# EAGLE design clare-head (EAGLE 9.6.2)
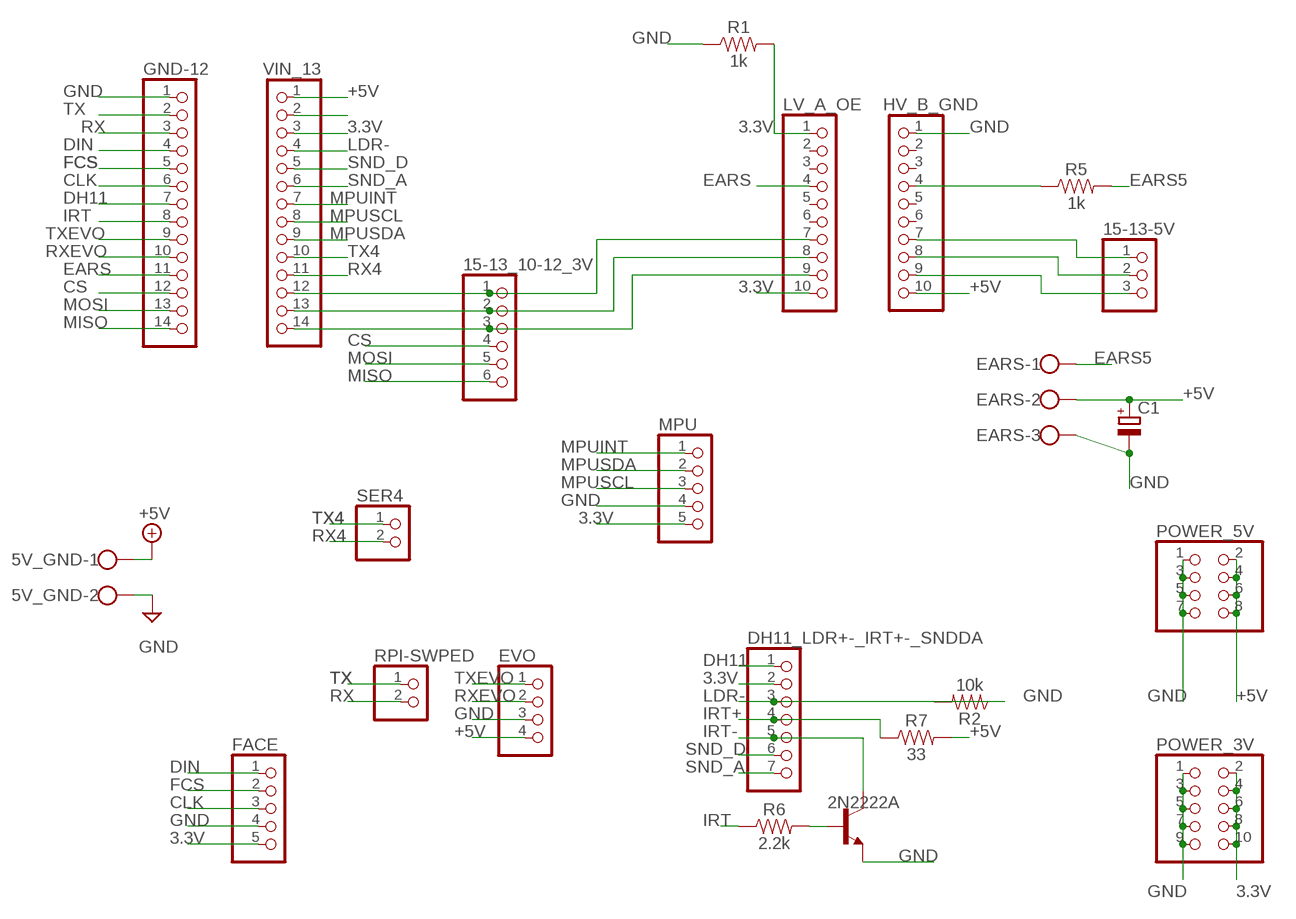
[diagram p0: schematic, sheet 1]

## Parts
2N2222A  2N2222A-NPN-TO18-EBC  [TO18]
5V_GND  W237-102  [W237-102]
15-13-5V  PINHD-1X3  [1X03]
15-13_10-12_3V  PINHD-1X6  [1X06]
C1  CPOL-EUE2,5-6E  [E2,5-6E]
DH11_LDR+-_IRT+-_SNDDA  PINHD-1X7  [1X07]
EARS  W237-103  [W237-103]
EVO  PINHD-1X4  [1X04]
FACE  PINHD-1X5  [1X05]
GND-12  PINHD-1X14  [1X14]
HV_B_GND  PINHD-1X10  [1X10]
LV_A_OE  PINHD-1X10  [1X10]
MPU  PINHD-1X5  [1X05]
POWER_3V  PINHD-2X5  [2X05]
POWER_5V  PINHD-2X4  [2X04]
R1  1k  1KOHM-HORIZ-1/4W-1%  [AXIAL-0.3]
R2  10k  1KOHM-HORIZ-1/4W-1%  [AXIAL-0.3]
R5  1k  1KOHM-HORIZ-1/4W-1%  [AXIAL-0.3]
R6  2.2k  1KOHM-HORIZ-1/4W-1%  [AXIAL-0.3]
R7  33  1KOHM-HORIZ-1/4W-1%  [AXIAL-0.3]
RPI-SWPED  PINHD-1X2  [1X02]
SER4  PINHD-1X2  [1X02]
VIN_13  PINHD-1X14  [1X14]

## Nets
3.3V: DH11_LDR+-_IRT+-_SNDDA.2 FACE.5 LV_A_OE.1 LV_A_OE.10 MPU.5 POWER_3V.2 POWER_3V.4 POWER_3V.6 POWER_3V.8 POWER_3V.10 R1.P$2 VIN_13.3
+5V: 5V_GND.1 C1.+ EARS.2 EVO.4 HV_B_GND.10 POWER_5V.2 POWER_5V.4 POWER_5V.6 POWER_5V.8 R7.P$2 VIN_13.1
CLK: FACE.3 GND-12.6
CS: 15-13_10-12_3V.4 GND-12.12
DH11: DH11_LDR+-_IRT+-_SNDDA.1 GND-12.7
DIN: FACE.1 GND-12.4
EARS: GND-12.11 LV_A_OE.4
EARS5: EARS.1 R5.P$2
FCS: FACE.2 GND-12.5
GND: 2N2222A.1(E) 5V_GND.2 C1.- EARS.3 EVO.3 FACE.4 GND-12.1 HV_B_GND.1 MPU.4 POWER_3V.1 POWER_3V.3 POWER_3V.5 POWER_3V.7 POWER_3V.9 POWER_5V.1 POWER_5V.3 POWER_5V.5 POWER_5V.7 R1.P$1 R2.P$1
IRT: GND-12.8 R6.P$1
IRT+: DH11_LDR+-_IRT+-_SNDDA.4 R7.P$1
IRT-: 2N2222A.3(C) DH11_LDR+-_IRT+-_SNDDA.5
LDR-: DH11_LDR+-_IRT+-_SNDDA.3 R2.P$2 VIN_13.4
MISO: 15-13_10-12_3V.6 GND-12.14
MOSI: 15-13_10-12_3V.5 GND-12.13
MPUINT: MPU.1 VIN_13.7
MPUSCL: MPU.3 VIN_13.8
MPUSDA: MPU.2 VIN_13.9
N$2: VIN_13.2
N$3: 2N2222A.2(B) R6.P$2
N$7: 15-13-5V.1 HV_B_GND.7
N$8: HV_B_GND.4 R5.P$1
N$9: 15-13-5V.2 HV_B_GND.8
N$10: 15-13-5V.3 HV_B_GND.9
N$14: 15-13_10-12_3V.1 LV_A_OE.7 VIN_13.12
N$15: 15-13_10-12_3V.2 LV_A_OE.8 VIN_13.13
N$16: 15-13_10-12_3V.3 LV_A_OE.9 VIN_13.14
RX: GND-12.3 RPI-SWPED.2
RX4: SER4.2 VIN_13.11
RXEVO: EVO.2 GND-12.10
SND_A: DH11_LDR+-_IRT+-_SNDDA.7 VIN_13.6
SND_D: DH11_LDR+-_IRT+-_SNDDA.6 VIN_13.5
TX: GND-12.2 RPI-SWPED.1
TX4: SER4.1 VIN_13.10
TXEVO: EVO.1 GND-12.9
Unconnected: HV_B_GND.2 HV_B_GND.3 HV_B_GND.5 HV_B_GND.6 LV_A_OE.2 LV_A_OE.3 LV_A_OE.5 LV_A_OE.6

## Library data of the parts
2N2222A = transistor:*-NPN-: NPN Transistror BF959 corrected 2008.03.06
5V_GND = con-wago-500:W237-102: WAGO SCREW CLAMP; MPN: 237-102; OC_FARNELL: unknown; OC_NEWARK: 70K9898
15-13-5V = pinhead:PINHD-1X3: PIN HEADER
15-13_10-12_3V = pinhead:PINHD-1X6: PIN HEADER
C1 = rcl:CPOL-EU: POLARIZED CAPACITOR, European symbol; SPICEPREFIX: C
DH11_LDR+-_IRT+-_SNDDA = pinhead:PINHD-1X7: PIN HEADER
EARS = con-wago-500:W237-103: WAGO SCREW CLAMP; MPN: 237-103; OC_FARNELL: unknown; OC_NEWARK: 18M7116
EVO = pinhead:PINHD-1X4: PIN HEADER
FACE MPU = pinhead:PINHD-1X5: PIN HEADER
GND-12 VIN_13 = pinhead:PINHD-1X14: PIN HEADER
HV_B_GND LV_A_OE = pinhead:PINHD-1X10: PIN HEADER
POWER_3V = pinhead:PINHD-2X5: PIN HEADER
POWER_5V = pinhead:PINHD-2X4: PIN HEADER
R1 R5 = SparkFun-Resistors:1KOHM: 1kΩ resistor A resistor is a passive two-terminal electrical component that implements electrical resistance as a circuit element. Resistors act to reduce current flow, and, at the same time, act to lower voltage levels within circuits. - Wikipedia; PROD_ID: RES-12182
R2 R6 R7 = SparkFun-Resistors:1KOHM: 1kΩ resistor A resistor is a passive two-terminal electrical component that implements electrical resistance as a circuit element. Resistors act to reduce current flow, and, at the same time, act to lower voltage levels within circuits. - Wikipedia; PROD_ID: RES-12182; VALUE: 1k
RPI-SWPED SER4 = pinhead:PINHD-1X2: PIN HEADER

## Board
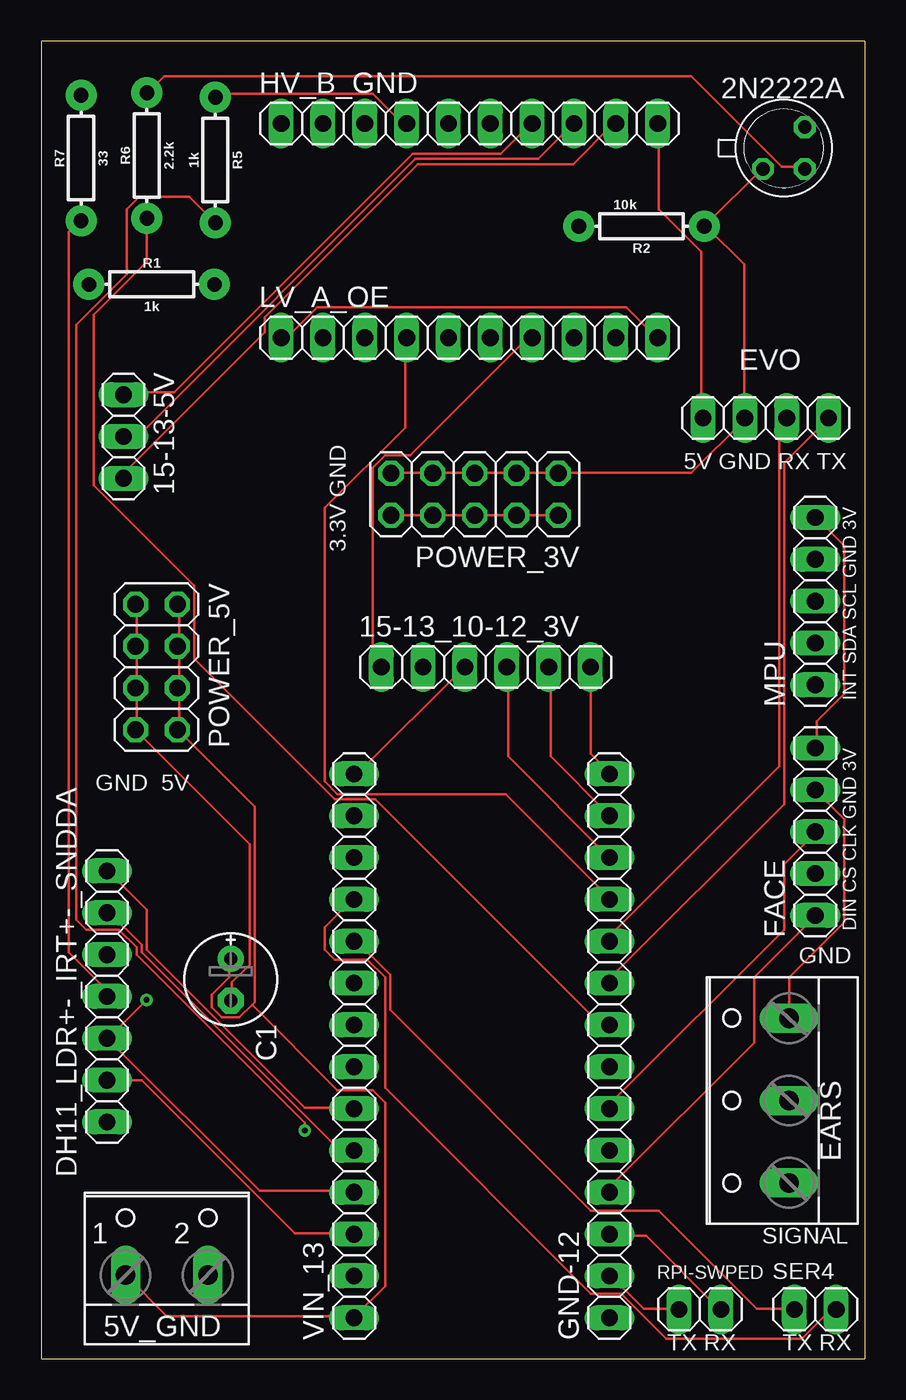
[diagram p1: board, top side]
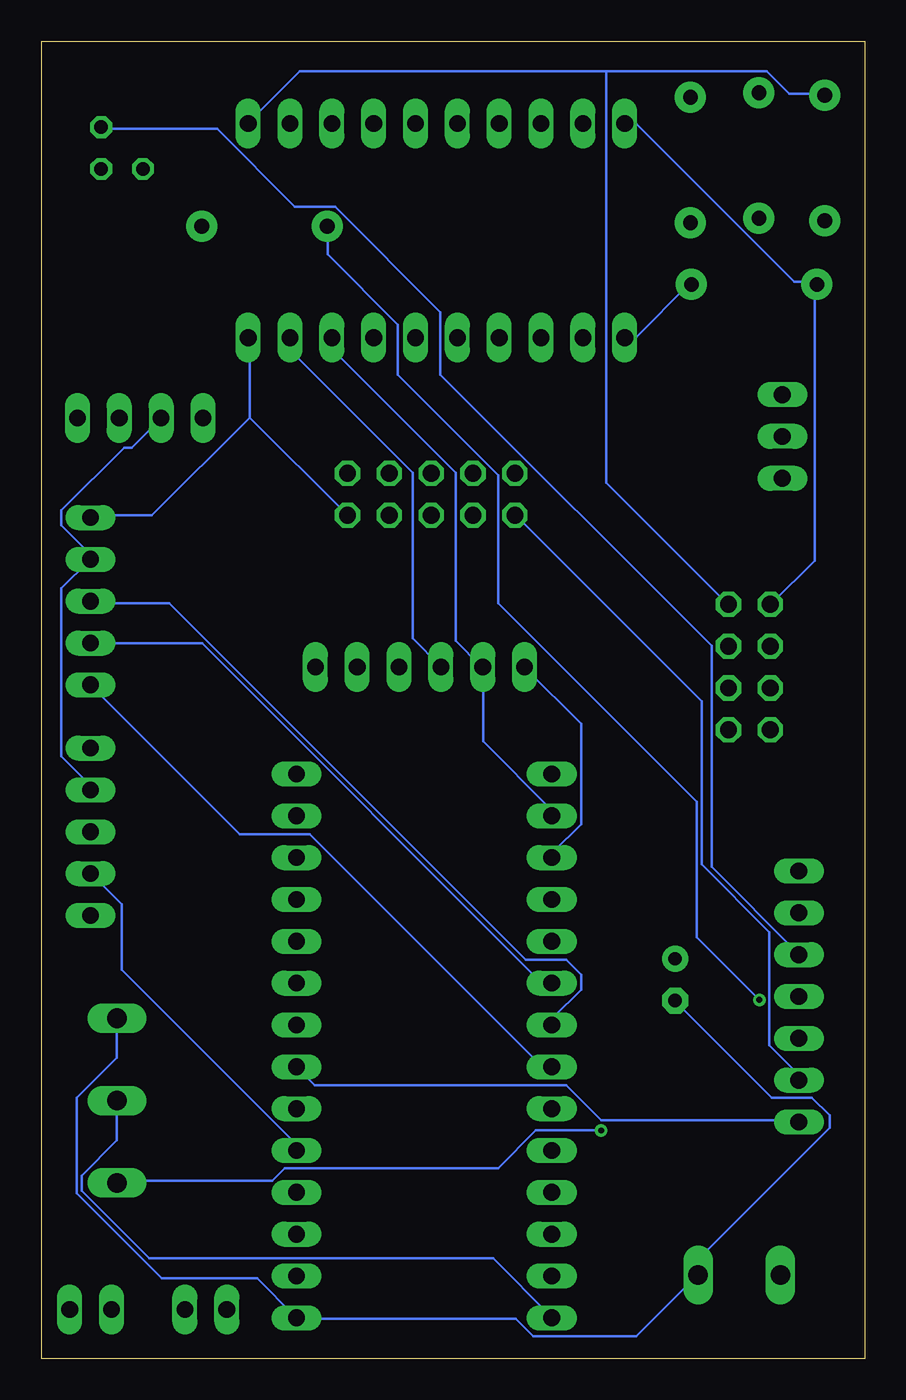
[diagram p2: board, bottom side, seen from below]

Size 50 x 80 mm. Coordinates in mm from the lower left corner, seen from the top.
Outline: 0,0 50,0 50,80 0,80 0,0
Copper layers (1*16): Top 0.035mm / dielectric 1.5mm / Bottom 0.035mm
Design rules "default": minimum track width 6mil, minimum drill 0.35mm, track to track 6mil, track to pad 6mil, pad to pad 6mil, via to via 6mil, smd to smd 6mil, copper to edge 40mil, drill to drill 6mil, minimum pad ring 10mil, minimum via ring 8mil, stop-mask expansion 4mil, vias tented up to drill 0mil, thermal gap 10mil

### Footprints (pad centres in the part's own frame; a part is rotated, then mirrored left to right if it is on the bottom)
TO18 = drill 0.813 octagon: 1 -1.27,-1.27; 2 1.27,-1.27; 3 1.27,1.27
W237-102 = drill 1.194 long: 1 -2.5,-1.27; 2 2.5,-1.27
1X03 = drill 1.016 long: 1 -2.54,0; 2 0,0; 3 2.54,0
1X06 = drill 1.016 long: 1 -6.35,0; 2 -3.81,0; 3 -1.27,0; 4 1.27,0; 5 3.81,0; 6 6.35,0
E2,5-6E = drill 0.813 pad 1.575: + -1.27,0 | drill 0.813 pad 1.575 octagon: - 1.27,0
1X07 = drill 1.016 long: 1 -7.62,0; 2 -5.08,0; 3 -2.54,0; 4 0,0; 5 2.54,0; 6 5.08,0; 7 7.62,0
W237-103 = drill 1.194 long: 1 -5,-1.29; 2 0,-1.29; 3 5,-1.29
1X04 = drill 1.016 long: 1 -3.81,0; 2 -1.27,0; 3 1.27,0; 4 3.81,0
1X05 = drill 1.016 long: 1 -5.08,0; 2 -2.54,0; 3 0,0; 4 2.54,0; 5 5.08,0
1X14 = drill 1.016 long: 1 -16.51,0; 2 -13.97,0; 3 -11.43,0; 4 -8.89,0; 5 -6.35,0; 6 -3.81,0; 7 -1.27,0; 8 1.27,0; 9 3.81,0; 10 6.35,0; 11 8.89,0; 12 11.43,0; 13 13.97,0; 14 16.51,0
1X10 = drill 1.016 long: 1 -11.43,0; 2 -8.89,0; 3 -6.35,0; 4 -3.81,0; 5 -1.27,0; 6 1.27,0; 7 3.81,0; 8 6.35,0; 9 8.89,0; 10 11.43,0
2X05 = drill 1.016 octagon: 1 -5.08,-1.27; 2 -5.08,1.27; 3 -2.54,-1.27; 4 -2.54,1.27; 5 0,-1.27; 6 0,1.27; 7 2.54,-1.27; 8 2.54,1.27; 9 5.08,-1.27; 10 5.08,1.27
2X04 = drill 1.016 octagon: 1 -3.81,-1.27; 2 -3.81,1.27; 3 -1.27,-1.27; 4 -1.27,1.27; 5 1.27,-1.27; 6 1.27,1.27; 7 3.81,-1.27; 8 3.81,1.27
AXIAL-0.3 = drill 0.9 pad 1.88: P$1 -3.81,0; P$2 3.81,0
1X02 = drill 1.016 long: 1 -1.27,0; 2 1.27,0

### Placement (x,y rotation side)
2N2222A  45.09,73.51 0 top
5V_GND  7.62,6.35 0 top
15-13-5V  5,56 270 top
15-13_10-12_3V  27,42 0 top
C1  11.51,23.02 270 top
DH11_LDR+-_IRT+-_SNDDA  4,22 90 top
EARS  44.11,15.68 90 top
EVO  43.99,57.12 180 top
FACE  47,32 90 top
GND-12  34.5,19 90 top
HV_B_GND  26,75 0 top
LV_A_OE  26,62 0 top
MPU  47,46 90 top
POWER_3V  26.32,52.49 180 top
POWER_5V  7,42 270 top
R1  6.71,65.23 0 top
R2  36.45,68.77 180 top
R5  10.58,72.78 270 top
R6  6.42,73.06 90 top
R7  2.42,72.9 90 top
RPI-SWPED  40,3 0 top
SER4  47,3 0 top
VIN_13  19,19 90 top

### Tracks (layer width: path | path; a pad name or v marks a point on that pad's centre or on a via)
3.3V
  Top 0.152: DH11_LDR+-_IRT+-_SNDDA.2 4.12,16.92 6.1,16.92 15.39,7.62 18.9,7.62 VIN_13.3 | FACE.5 47.09,37.19 47.09,38.71 48.77,40.39 48.77,49.38 47.09,51.05 MPU.5 | POWER_3V.10 21.34,51.21 23.77,51.21 POWER_3V.8 23.93,51.21 26.21,51.21 POWER_3V.6 26.36,51.21 28.8,51.21 POWER_3V.4 28.96,51.21 31.39,51.21 POWER_3V.2 | LV_A_OE.1 14.63,62.03 14.94,62.03 16.76,63.86 35.51,63.86 37.34,62.03 LV_A_OE.10
  Bottom 0.152: LV_A_OE.1 14.48,62.03 13.87,62.03 10.67,65.23 R1.P$2 | 37.34,57.15 37.34,61.87 LV_A_OE.10 | 37.34,57.15 31.55,51.36 POWER_3V.2 | 37.34,57.15 43.28,51.21 46.94,51.21 MPU.5 | DH11_LDR+-_IRT+-_SNDDA.2 4.12,17.07 4.12,17.37 5.79,19.05 5.79,25.91 9.91,30.02 9.91,39.93 21.18,51.21 POWER_3V.10
+5V
  Top 0.152: EVO.4 40.08,57.15 40.08,67.21 37.49,69.8 37.49,74.98 HV_B_GND.10 | POWER_5V.2 8.38,45.72 8.38,43.28 POWER_5V.4 8.38,43.13 8.38,40.84 POWER_5V.6 8.38,40.69 8.38,38.25 POWER_5V.8 8.38,38.1 12.95,33.53 12.95,21.64 12.8,21.49 | 12.8,21.49 12.04,20.73 10.97,20.73 10.36,21.34 10.36,22.1 11.43,23.16 11.43,24.23 C1.+ | 5V_GND.1 5.18,5.03 7.62,2.59 18.9,2.59 VIN_13.1 19.05,2.59 20.88,4.42 20.88,15.54 20.12,16.31 17.98,16.31 12.8,21.49
  Bottom 0.152: 15.7,78.18 34.29,78.18 37.34,75.13 HV_B_GND.10 | 15.7,78.18 5.94,78.18 4.57,76.81 2.44,76.81 R7.P$2 | EARS.2 45.41,15.54 45.41,13.26 47.55,11.12 47.55,10.21 43.43,6.1 22.55,6.1 19.05,2.59 VIN_13.1 | 15.7,78.18 15.7,53.19 8.38,45.87 POWER_5V.2
CLK
  Top 0.152: GND-12.6 34.59,15.24 34.59,15.54 45.11,26.06 45.11,30.02 46.94,31.85 FACE.3
CS
  Top 0.152: 15-13_10-12_3V.4 28.35,41.91 28.35,36.58 34.44,30.48 GND-12.12
DH11
  Bottom 0.152: DH11_LDR+-_IRT+-_SNDDA.1 4.12,14.48 16,14.48 18.14,16.61 33.38,16.61 34.44,17.68 GND-12.7
DIN
  Top 0.152: GND-12.4 34.59,10.21 34.59,10.52 43.28,19.2 43.28,23.16 46.94,26.82 FACE.1
EARS
  Top 0.152: LV_A_OE.4 22.1,61.87 22.1,56.54 17.22,51.66 17.22,35.05 17.98,34.29 28.19,34.29 34.44,28.04 GND-12.11
EARS5  (via drill 0.35)
  Top 0.152: v16,13.87 16,14.33 5.79,24.54 5.79,24.99 4.72,26.06 2.74,26.06 2.13,26.67 2.13,62.79 5.18,65.84 5.18,69.8 5.94,70.56 8.99,70.56 10.52,69.04 R5.P$2
  Bottom 0.152: v16,13.87 19.96,13.87 22.25,11.58 35.2,11.58 35.97,10.82 45.26,10.82 EARS.1
FCS
  Bottom 0.152: GND-12.5 34.59,12.8 34.59,13.11 45.11,23.62 45.11,27.58 46.94,29.41 FACE.2
GND
  Top 0.152: EARS.3 45.41,20.73 45.41,23.16 48.77,26.52 48.77,32.77 47.09,34.44 FACE.4 | POWER_3V.9 21.34,53.8 23.77,53.8 POWER_3V.7 23.93,53.8 26.21,53.8 POWER_3V.5 26.36,53.8 28.8,53.8 POWER_3V.3 28.96,53.8 31.39,53.8 POWER_3V.1 31.55,53.8 39.47,53.8 42.67,57 EVO.3 42.67,57.15 42.67,66.45 40.39,68.73 R2.P$1 40.39,68.89 43.74,72.24 2N2222A.1 | POWER_5V.1 5.79,45.72 5.79,43.28 POWER_5V.3 5.79,43.13 5.79,40.84 POWER_5V.5 5.79,40.69 5.79,38.25 POWER_5V.7 5.79,38.1 12.65,31.24 12.65,23.93 11.58,22.86 11.58,21.79 C1.-
  Bottom 0.152: FACE.4 47.09,34.59 47.09,34.9 48.77,36.58 48.77,46.79 47.09,48.46 MPU.4 47.09,48.62 47.09,48.92 48.77,50.6 48.77,51.51 44.96,55.32 44.5,55.32 42.82,57 EVO.3 | HV_B_GND.1 14.48,74.98 13.87,74.98 4.27,65.38 3.05,65.38 R1.P$1 3.05,65.23 3.05,48.46 5.64,45.87 POWER_5V.1 | C1.- 11.43,21.64 5.64,15.85 3.2,15.85 2.13,14.78 2.13,14.02 10.06,6.1 10.06,5.18 5V_GND.2 10.21,5.03 13.87,1.37 20.12,1.37 21.18,2.44 34.44,2.44 GND-12.1 34.59,2.59 36.88,4.88 42.67,4.88 47.85,10.06 47.85,15.85 45.41,18.29 45.41,20.57 EARS.3
IRT
  Top 0.152: GND-12.8 34.44,20.42 33.83,20.42 20.27,33.98 17.83,33.98 9.3,42.52 9.3,46.94 3.2,53.03 3.2,63.4 6.4,66.6 6.4,69.19 R6.P$1
IRT+
  Top 0.152: DH11_LDR+-_IRT+-_SNDDA.4 3.96,22.1 3.96,22.4 1.68,24.69 1.68,68.43 2.29,69.04 R7.P$1
IRT-
  Bottom 0.152: 2N2222A.3 46.33,74.68 39.32,74.68 34.59,69.95 32.16,69.95 25.76,63.55 25.76,59.74 9.3,43.28 9.3,29.87 4.12,24.69 DH11_LDR+-_IRT+-_SNDDA.5
LDR-  (via drill 0.35)
  Top 0.152: VIN_13.4 18.9,10.21 13.26,10.21 4.12,19.36 DH11_LDR+-_IRT+-_SNDDA.3 4.12,19.51 v6.4,21.79
  Bottom 0.152: v6.4,21.79 10.21,25.6 10.21,33.83 22.25,45.87 22.25,53.65 28.35,59.74 28.35,62.79 32.61,67.06 32.61,68.73 R2.P$2
MISO
  Top 0.152: 15-13_10-12_3V.6 33.38,41.91 33.38,36.73 34.44,35.66 GND-12.14
MOSI
  Top 0.152: 15-13_10-12_3V.5 30.94,41.91 30.94,36.58 34.44,33.07 GND-12.13
MPUINT
  Bottom 0.152: VIN_13.7 19.05,17.83 19.66,17.83 33.68,31.85 37.95,31.85 46.94,40.84 MPU.1
MPUSCL
  Bottom 0.152: VIN_13.8 18.9,20.42 18.9,20.73 17.22,22.4 17.22,23.32 18.14,24.23 20.57,24.23 42.22,45.87 46.94,45.87 MPU.3
MPUSDA
  Bottom 0.152: VIN_13.9 19.05,22.86 19.66,22.86 40.23,43.43 46.94,43.43 MPU.2
N$3
  Top 0.152: 2N2222A.2 46.33,72.39 44.96,72.39 39.47,77.88 7.47,77.88 6.55,76.96 R6.P$2
N$7
  Top 0.152: 15-13-5V.1 5.03,58.67 8.08,58.67 22.55,73.15 27.89,73.15 29.72,74.98 HV_B_GND.7
N$8
  Top 0.152: HV_B_GND.4 22.1,75.13 21.79,75.13 20.12,76.81 10.82,76.81 10.67,76.66 R5.P$1
N$9
  Top 0.152: 15-13-5V.2 5.03,56.08 5.94,56.08 22.71,72.85 30.18,72.85 32.31,74.98 HV_B_GND.8
N$10
  Top 0.152: 15-13-5V.3 5.03,53.49 5.03,53.8 13.56,62.33 13.56,63.25 22.86,72.54 32.31,72.54 34.75,74.98 HV_B_GND.9
N$14
  Top 0.152: LV_A_OE.7 29.72,61.87 29.41,61.87 22.4,54.86 20.88,54.86 20.12,54.1 20.12,42.52 20.57,42.06 15-13_10-12_3V.1
  Bottom 0.152: VIN_13.12 18.9,30.48 18.9,30.79 17.22,32.46 17.22,38.56 20.57,41.91 15-13_10-12_3V.1
N$15
  Bottom 0.152: VIN_13.13 19.05,33.07 19.05,33.38 23.16,37.49 23.16,41.91 15-13_10-12_3V.2 23.32,42.06 24.84,43.59 24.84,53.8 32.31,61.27 32.31,61.87 LV_A_OE.8
N$16
  Top 0.152: VIN_13.14 19.05,35.66 19.36,35.66 25.6,41.91 15-13_10-12_3V.3
  Bottom 0.152: LV_A_OE.9 34.75,61.87 34.75,61.11 27.43,53.8 27.43,43.74 25.76,42.06 15-13_10-12_3V.3
RX
  Top 0.152: RPI-SWPED.2 41.15,3.05 36.73,7.47 34.59,7.47 GND-12.3
RX4
  Top 0.152: SER4.2 48.16,2.9 47.85,2.9 46.18,1.22 37.95,1.22 35.2,3.96 33.38,3.96 20.88,16.46 20.88,23.16 19.81,24.23 17.83,24.23 17.22,24.84 17.22,26.21 18.9,27.89 VIN_13.11
RXEVO
  Top 0.152: GND-12.10 34.59,25.45 34.59,25.76 44.81,35.97 44.81,56.69 45.11,57 EVO.2
SND_A
  Top 0.152: VIN_13.6 18.9,15.24 16,15.24 6.4,24.84 6.4,27.28 4.12,29.57 DH11_LDR+-_IRT+-_SNDDA.7
SND_D
  Top 0.152: VIN_13.5 18.9,12.8 17.98,12.8 6.1,24.69 6.1,25.15 4.12,27.13 DH11_LDR+-_IRT+-_SNDDA.6
TX
  Top 0.152: RPI-SWPED.1 38.71,3.05 36.58,3.05 34.59,5.03 GND-12.2
TX4
  Top 0.152: SER4.1 45.72,3.05 43.43,3.05 37.49,8.99 33.38,8.99 21.18,21.18 21.18,23.32 19.05,25.45 VIN_13.10
TXEVO
  Top 0.152: GND-12.9 34.59,22.86 34.59,23.16 45.11,33.68 45.11,54.41 47.7,57 EVO.1

### Text on the board
tNames: 5V GND RX TX | 3.3V GND | INT SDA SCL GND 3V | GND 5V | DIN CS CLK GND 3V | GND | SIGNAL | TX RX | TX RX